# Altium project StrathimFlightControllerV1.0.PrjPcb
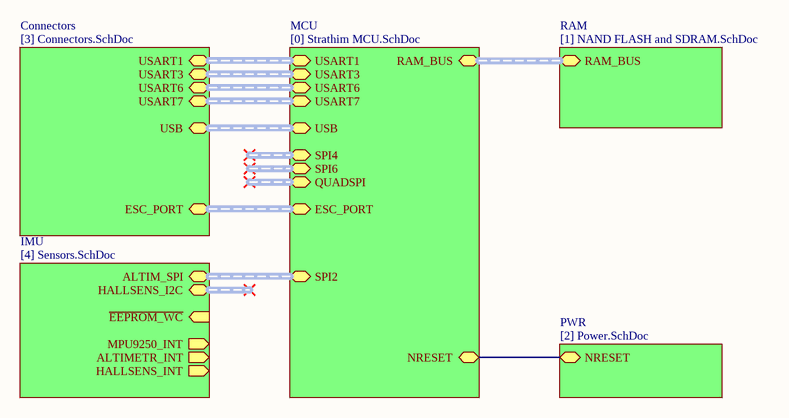
[diagram p0: Strathim block-scheme.SchDoc]
6 sheets, 125 parts. Net scope: hierarchical (ports join the sheet entries above them; power ports are global).
Board file: Strathim PCB V1.0 (1 try).PcbDoc
Sheets:
  Strathim block-scheme.SchDoc
    MCU = [0] Strathim MCU.SchDoc
    RAM = [1] NAND FLASH and SDRAM.SchDoc
    PWR = [2] Power.SchDoc
    Connectors = [3] Connectors.SchDoc
    IMU = [4] Sensors.SchDoc

## Sheet Strathim block-scheme.SchDoc
size A

### Sub-sheets
Connectors = [3] Connectors.SchDoc: USART1 (harness UART), USART6 (harness UART), USART3 (harness UART), USART7 (harness UART), ESC_PORT (harness ESC_CHANNELS), USB (harness USB)
IMU = [4] Sensors.SchDoc: MPU9250_INT (out), ALTIM_SPI (harness SPI), ~{EEPROM_WC} (in), HALLSENS_I2C (harness I2C), ALTIMETR_INT (out), HALLSENS_INT (out)
MCU = [0] Strathim MCU.SchDoc: RAM_BUS (harness RAM), USART6 (harness UART), USART3 (harness UART), ESC_PORT (harness ESC_CHANNELS), USART1 (harness UART), USART7 (harness UART), SPI4 (harness SPI), SPI2 (harness SPI), SPI6 (harness SPI), QUADSPI (harness QUADSPI), NRESET, USB (harness USB)
PWR = [2] Power.SchDoc: NRESET
RAM = [1] NAND FLASH and SDRAM.SchDoc: RAM_BUS (harness RAM)

### Nets
NRESET: sheet MCU/NRESET, sheet PWR/NRESET

### Buses and harness runs
harness sheet Connectors/ESC_PORT = sheet MCU/ESC_PORT
harness sheet Connectors/USART1 = sheet MCU/USART1
harness sheet Connectors/USART3 = sheet MCU/USART3
harness sheet Connectors/USART6 = sheet MCU/USART6
harness sheet Connectors/USART7 = sheet MCU/USART7
harness sheet Connectors/USB = sheet MCU/USB
harness sheet IMU/ALTIM_SPI = sheet MCU/SPI2
harness sheet MCU/RAM_BUS = sheet RAM/RAM_BUS

## Sheet [0] Strathim MCU.SchDoc
size A3
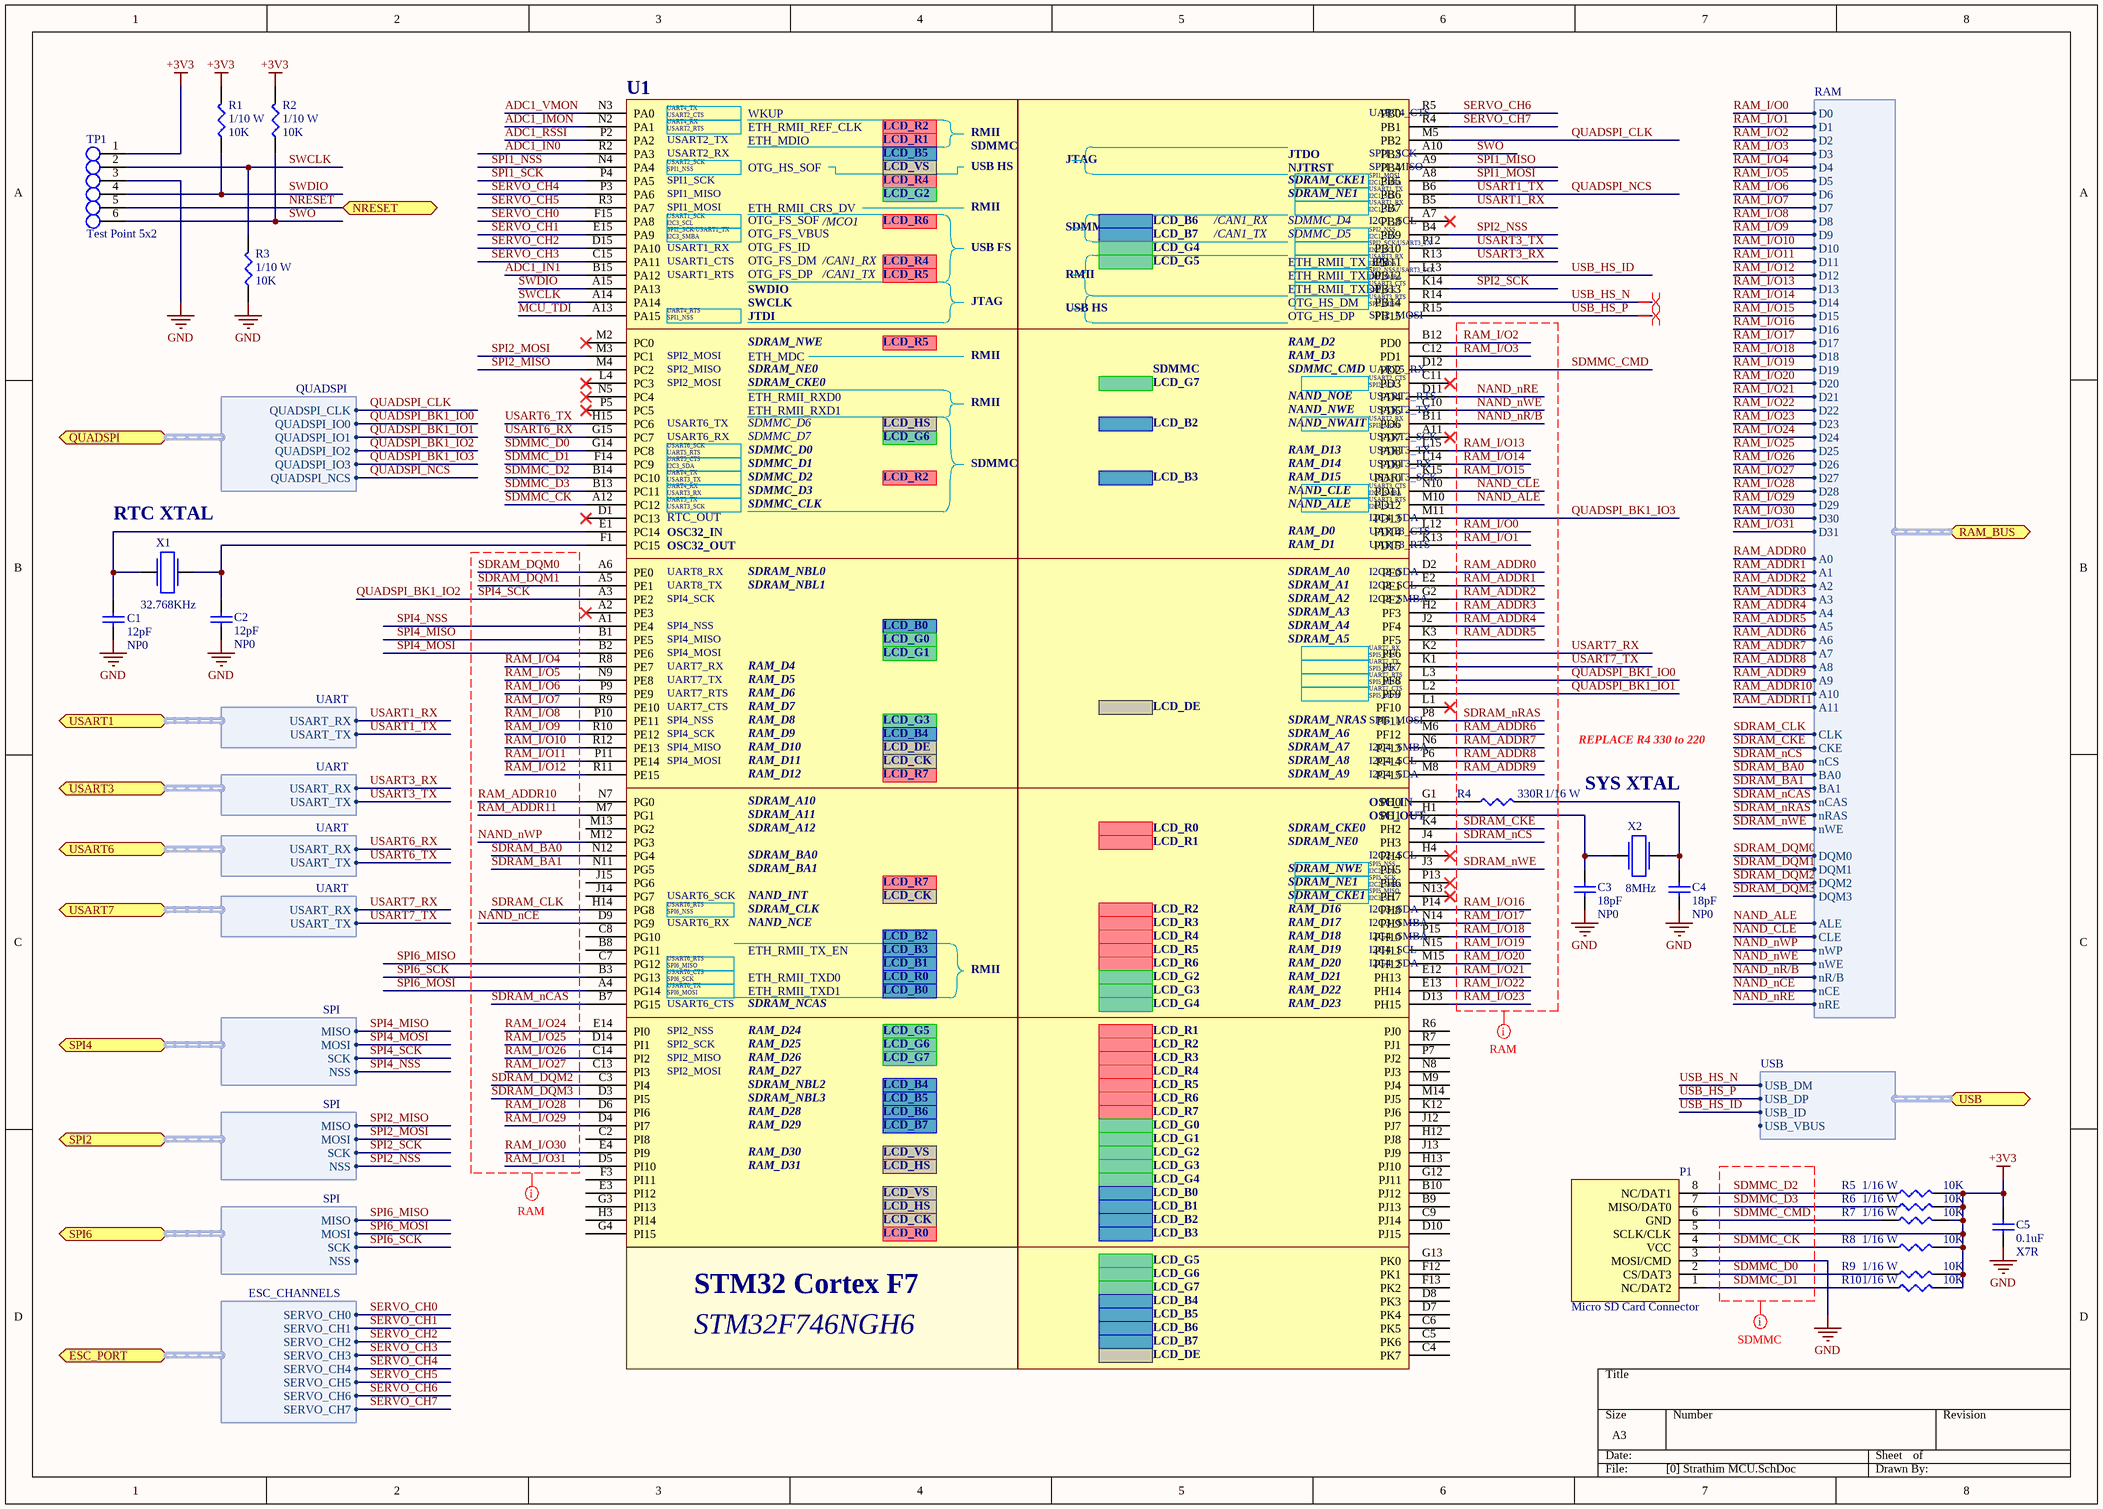
[diagram p1: [0] Strathim MCU.SchDoc]

### Parts
C1  value 12pF  Type: NP0  [CAP0402]  (hidden comment: ChipCap 12 NP0)
C2  value 12pF  Type: NP0  [CAP0402]  (hidden comment: ChipCap 12 NP0)
C3  value 18pF  Type: NP0  [CAP0402]  (hidden comment: ChipCap 18 NP0)
C4  value 18pF  Type: NP0  [CAP0402]  (hidden comment: ChipCap 18 NP0)
C5  value 0.1uF  Type: X7R  [CAP0402]  (hidden comment: ChipCap 0.1u X7R)
P1  Micro SD Card Connector  [WR-CRD SD Micro]
R1  value 10K  Rating: 1/10 W  [RES0603]  (hidden comment: RES0603 10K 1%)
R2  value 10K  Rating: 1/10 W  [RES0603]  (hidden comment: RES0603 10K 1%)
R3  value 10K  Rating: 1/10 W  [RES0603]  (hidden comment: RES0603 10K 1%)
R4  value 330R  Rating: 1/16 W  [RES0402]  (hidden comment: RES0402 330R 1%)
R5  value 10K  Rating: 1/16 W  [RES0402]  (hidden comment: RES0402 10K 1%)
R6  value 10K  Rating: 1/16 W  [RES0402]  (hidden comment: RES0402 10K 1%)
R7  value 10K  Rating: 1/16 W  [RES0402]  (hidden comment: RES0402 10K 1%)
R8  value 10K  Rating: 1/16 W  [RES0402]  (hidden comment: RES0402 10K 1%)
R9  value 10K  Rating: 1/16 W  [RES0402]  (hidden comment: RES0402 10K 1%)
R10  value 10K  Rating: 1/16 W  [RES0402]  (hidden comment: RES0402 10K 1%)
TP1  Test Point 5x2  [PG-1.5-13.5-6P-2.54PH]
U1  STM32F746NGH6  [TFBGA216]  (value not drawn)  (parts A,B,C,D,E,F,G,H,I,J,K of 12)
X1  value 32.768KHz  [KX-327NHT]  (hidden comment: XTAL)
X2  value 8MHz  [ABM3 Ceramic Crystal]  (hidden comment: XTAL)

### Ports
ESC_PORT (harness ESC_CHANNELS), NRESET, QUADSPI (harness QUADSPI), RAM_BUS (harness RAM), SPI2 (harness SPI), SPI4 (harness SPI), SPI6 (harness SPI), USART1 (harness UART), USART3 (harness UART), USART6 (harness UART), USART7 (harness UART), USB (harness USB)

### Harnesses
RAM: D0, D1, D2, D3, D4, D6, D7, D8, D9, D10, D11, D12, D13, D14, D15, D16, D17, D18, D19, D20, D21, D22, D23, D24, D25, D26, D27, D28, D29, D30, D31, A0, A1, A2, A3, A4, A5, A6, A7, A8, A9, A10, A11, CLK, CKE, nCS, BA0, BA1, nCAS, nRAS, nWE, DQM0, DQM1, DQM2, DQM3, ALE, CLE, nWP, nWE, nR/B, nCE, nRE, D5
ESC_CHANNELS: SERVO_CH0, SERVO_CH1, SERVO_CH2, SERVO_CH3, SERVO_CH4, SERVO_CH5, SERVO_CH6, SERVO_CH7
UART: USART_RX, USART_TX
SPI: MISO, MOSI, SCK, NSS
QUADSPI: QUADSPI_CLK, QUADSPI_IO0, QUADSPI_IO1, QUADSPI_IO2, QUADSPI_IO3, QUADSPI_NCS
USB: USB_DM, USB_DP, USB_ID, USB_VBUS

### Nets
+3V3: C5.2 P1.5(SCLK/CLK) R1.2 R2.2 R5.2 R6.2 R7.2 R8.2 R9.2 R10.2 TP1.1
GND: C1.1 C2.1 C3.1 C4.1 C5.1 P1.3(MOSI/CMD) R3.1 TP1.3
ADC1_IMON: U1.N2(PA1)
ADC1_IN0: U1.R2(PA3)
ADC1_IN1: U1.B15(PA12)
ADC1_RSSI: U1.P2(PA2)
ADC1_VMON: U1.N3(PA0)
MCU_TDI: U1.A13(PA15)
NAND_ALE: U1.M10(PD12) ; port RAM_BUS.ALE
NAND_CLE: U1.N10(PD11) ; port RAM_BUS.CLE
NAND_nCE: U1.D9(PG9) ; port RAM_BUS.nCE
NAND_nR/B: U1.B11(PD6) ; port RAM_BUS.nR/B
NAND_nRE: U1.D11(PD4) ; port RAM_BUS.nRE
NAND_nWE: U1.C10(PD5) U1.J3(PH5) ; port RAM_BUS.nWE  [also labelled SDRAM_nWE]
NAND_nWP: U1.M12(PG3) ; port RAM_BUS.nWP
NRESET: TP1.5 ; port NRESET
QUADSPI_BK1_IO0: U1.L3(PF8) ; port QUADSPI.QUADSPI_IO0
QUADSPI_BK1_IO1: U1.L2(PF9) ; port QUADSPI.QUADSPI_IO1
QUADSPI_BK1_IO2: U1.A3(PE2) ; port SPI4.SCK, port QUADSPI.QUADSPI_IO2  [also labelled SPI4_SCK]
QUADSPI_BK1_IO3: U1.M11(PD13) ; port QUADSPI.QUADSPI_IO3
QUADSPI_CLK: U1.M5(PB2) ; port QUADSPI.QUADSPI_CLK
QUADSPI_NCS: U1.B6(PB6) ; port USART1.USART_TX, port QUADSPI.QUADSPI_NCS  [also labelled USART1_TX]
RAM_ADDR0: U1.D2(PF0) ; port RAM_BUS.A0
RAM_ADDR1: U1.E2(PF1) ; port RAM_BUS.A1
RAM_ADDR2: U1.G2(PF2) ; port RAM_BUS.A2
RAM_ADDR3: U1.H2(PF3) ; port RAM_BUS.A3
RAM_ADDR4: U1.J2(PF4) ; port RAM_BUS.A4
RAM_ADDR5: U1.K3(PF5) ; port RAM_BUS.A5
RAM_ADDR6: U1.M6(PF12) ; port RAM_BUS.A6
RAM_ADDR7: U1.N6(PF13) ; port RAM_BUS.A7
RAM_ADDR8: U1.P6(PF14) ; port RAM_BUS.A8
RAM_ADDR9: U1.M8(PF15) ; port RAM_BUS.A9
RAM_ADDR10: U1.N7(PG0) ; port RAM_BUS.A10
RAM_ADDR11: U1.M7(PG1) ; port RAM_BUS.A11
RAM_I/O0: U1.L12(PD14) ; port RAM_BUS.D0
RAM_I/O1: U1.K13(PD15) ; port RAM_BUS.D1
RAM_I/O2: U1.B12(PD0) ; port RAM_BUS.D2
RAM_I/O3: U1.C12(PD1) ; port RAM_BUS.D3
RAM_I/O4: U1.R8(PE7) ; port RAM_BUS.D4
RAM_I/O5: U1.N9(PE8) ; port RAM_BUS.D5
RAM_I/O6: U1.P9(PE9) ; port RAM_BUS.D6
RAM_I/O7: U1.R9(PE10) ; port RAM_BUS.D7
RAM_I/O8: U1.P10(PE11) ; port RAM_BUS.D8
RAM_I/O9: U1.R10(PE12) ; port RAM_BUS.D9
RAM_I/O10: U1.R12(PE13) ; port RAM_BUS.D10
RAM_I/O11: U1.P11(PE14) ; port RAM_BUS.D11
RAM_I/O12: U1.R11(PE15) ; port RAM_BUS.D12
RAM_I/O13: U1.L15(PD8) ; port RAM_BUS.D13
RAM_I/O14: U1.L14(PD9) ; port RAM_BUS.D14
RAM_I/O15: U1.K15(PD10) ; port RAM_BUS.D15
RAM_I/O16: U1.P14(PH8) ; port RAM_BUS.D16
RAM_I/O17: U1.N14(PH9) ; port RAM_BUS.D17
RAM_I/O18: U1.P15(PH10) ; port RAM_BUS.D18
RAM_I/O19: U1.N15(PH11) ; port RAM_BUS.D19
RAM_I/O20: U1.M15(PH12) ; port RAM_BUS.D20
RAM_I/O21: U1.E12(PH13) ; port RAM_BUS.D21
RAM_I/O22: U1.E13(PH14) ; port RAM_BUS.D22
RAM_I/O23: U1.D13(PH15) ; port RAM_BUS.D23
RAM_I/O24: U1.E14(PI0) ; port RAM_BUS.D24
RAM_I/O25: U1.D14(PI1) ; port RAM_BUS.D25
RAM_I/O26: U1.C14(PI2) ; port RAM_BUS.D26
RAM_I/O27: U1.C13(PI3) ; port RAM_BUS.D27
RAM_I/O28: U1.D6(PI6) ; port RAM_BUS.D28
RAM_I/O29: U1.D4(PI7) ; port RAM_BUS.D29
RAM_I/O30: U1.E4(PI9) ; port RAM_BUS.D30
RAM_I/O31: U1.D5(PI10) ; port RAM_BUS.D31
SDMMC_CK: P1.4(VCC) R8.1 U1.A12(PC12)
SDMMC_CMD: P1.6(GND) R7.1 U1.D12(PD2)
SDMMC_D0: P1.2(CS/DAT3) R9.1 U1.G14(PC8)
SDMMC_D1: P1.1(NC/DAT2) R10.1 U1.F14(PC9)
SDMMC_D2: P1.8(NC/DAT1) R5.1 U1.B14(PC10)
SDMMC_D3: P1.7(MISO/DAT0) R6.1 U1.B13(PC11)
SDRAM_BA0: U1.N12(PG4) ; port RAM_BUS.BA0
SDRAM_BA1: U1.N11(PG5) ; port RAM_BUS.BA1
SDRAM_CKE: U1.K4(PH2) ; port RAM_BUS.CKE
SDRAM_CLK: U1.H14(PG8) ; port RAM_BUS.CLK
SDRAM_DQM0: U1.A6(PE0) ; port RAM_BUS.DQM0
SDRAM_DQM1: U1.A5(PE1) ; port RAM_BUS.DQM1
SDRAM_DQM2: U1.C3(PI4) ; port RAM_BUS.DQM2
SDRAM_DQM3: U1.D3(PI5) ; port RAM_BUS.DQM3
SDRAM_nCAS: U1.B7(PG15) ; port RAM_BUS.nCAS
SDRAM_nCS: U1.J4(PH3) ; port RAM_BUS.nCS
SDRAM_nRAS: U1.P8(PF11) ; port RAM_BUS.nRAS
SERVO_CH0: U1.F15(PA8) ; port ESC_PORT.SERVO_CH0
SERVO_CH1: U1.E15(PA9) ; port ESC_PORT.SERVO_CH1
SERVO_CH2: U1.D15(PA10) ; port ESC_PORT.SERVO_CH2
SERVO_CH3: U1.C15(PA11) ; port ESC_PORT.SERVO_CH3
SERVO_CH4: U1.P3(PA6) ; port ESC_PORT.SERVO_CH4
SERVO_CH5: U1.R3(PA7) ; port ESC_PORT.SERVO_CH5
SERVO_CH6: U1.R5(PB0) ; port ESC_PORT.SERVO_CH6
SERVO_CH7: U1.R4(PB1) ; port ESC_PORT.SERVO_CH7
SPI1_MISO: U1.A9(PB4)
SPI1_MOSI: U1.A8(PB5)
SPI1_NSS: U1.N4(PA4)
SPI1_SCK: U1.P4(PA5)
SPI2_MISO: U1.M4(PC2) ; port SPI2.MISO  [project net ALT_MISO]
SPI2_MOSI: U1.M3(PC1) ; port SPI2.MOSI  [project net ALT_MOSI]
SPI2_NSS: U1.B4(PB9) ; port SPI2.NSS  [project net ALT_CS]
SPI2_SCK: U1.K14(PB13) ; port SPI2.SCK  [project net ALT_SCLK]
SPI4_MISO: U1.B1(PE5) ; port SPI4.MISO
SPI4_MOSI: U1.B2(PE6) ; port SPI4.MOSI
SPI4_NSS: U1.A1(PE4) ; port SPI4.NSS
SPI6_MISO: U1.C7(PG12) ; port SPI6.MISO
SPI6_MOSI: U1.A4(PG14) ; port SPI6.MOSI
SPI6_SCK: U1.B3(PG13) ; port SPI6.SCK
SWCLK: R3.2 TP1.2 U1.A14(PA14)
SWDIO: R1.1 TP1.4 U1.A15(PA13)
SWO: R2.1 TP1.6 U1.A10(PB3)
USART1_RX: U1.B5(PB7) ; port USART1.USART_RX
USART3_RX: U1.R13(PB11) ; port USART3.USART_RX
USART3_TX: U1.P12(PB10) ; port USART3.USART_TX
USART6_RX: U1.G15(PC7) ; port USART6.USART_RX
USART6_TX: U1.H15(PC6) ; port USART6.USART_TX
USART7_RX: U1.K2(PF6) ; port USART7.USART_RX
USART7_TX: U1.K1(PF7) ; port USART7.USART_TX
USB_HS_ID: U1.L13(PB12) ; port USB.USB_ID
USB_HS_N: U1.R14(PB14) ; port USB.USB_DM
USB_HS_P: U1.R15(PB15) ; port USB.USB_DP
NetC1_2: C1.2 U1.E1(PC14) X1.1
NetC2_2: C2.2 U1.F1(PC15) X1.2
NetC3_2: C3.2 U1.H1(PH1) X2.1
NetC4_2: C4.2 R4.2 X2.2
NetR4_1: R4.1 U1.G1(PH0)

Not connected (* = marked no-connect by the designer): U1 A2(PE3)* A7(PB8)* A11(PD7)* B8(PG11) B9(PJ13) B10(PJ12) C2(PI8) C4(PK7) C5(PK6) C6(PK5) C8(PG10) C9(PJ14) C11(PD3)* D1(PC13)* D7(PK4) D8(PK3) D10(PJ15) E3(PI12) F3(PI11) F12(PK1) F13(PK2) G3(PI13) G4(PI15) G12(PJ11) G13(PK0) H3(PI14) H4(PH4)* H12(PJ8) H13(PJ10) J12(PJ7) J13(PJ9) J14(PG7) J15(PG6) K12(PJ6) L1(PF10)* L4(PC3)* M2(PC0)* M9(PJ4) M13(PG2) M14(PJ5) N5(PC4)* N8(PJ3) N13(PH7)* P5(PC5)* P7(PJ2) P13(PH6)* R6(PJ0) R7(PJ1)

### Layout directives
net class SDMMC: SDMMC_CK, SDMMC_CMD, SDMMC_D0, SDMMC_D1, SDMMC_D2, SDMMC_D3
net class RAM: NAND_ALE, NAND_CLE, NAND_nCE, NAND_nR/B, NAND_nRE, NAND_nWE, NAND_nWP, RAM_ADDR0, RAM_ADDR1, RAM_ADDR2, RAM_ADDR3, RAM_ADDR4, RAM_ADDR5, RAM_ADDR6, RAM_ADDR7, RAM_ADDR8, RAM_ADDR9, RAM_ADDR10, RAM_ADDR11, RAM_I/O0, RAM_I/O1, RAM_I/O2, RAM_I/O3, RAM_I/O4, RAM_I/O5, RAM_I/O6, RAM_I/O7, RAM_I/O8, RAM_I/O9, RAM_I/O10, RAM_I/O11, RAM_I/O12, RAM_I/O13, RAM_I/O14, RAM_I/O15, RAM_I/O16, RAM_I/O17, RAM_I/O18, RAM_I/O19, RAM_I/O20, RAM_I/O21, RAM_I/O22, RAM_I/O23, RAM_I/O24, RAM_I/O25, RAM_I/O26, RAM_I/O27, RAM_I/O28, RAM_I/O29, RAM_I/O30, RAM_I/O31, SDRAM_BA0, SDRAM_BA1, SDRAM_CKE, SDRAM_CLK, SDRAM_DQM0, SDRAM_DQM1, SDRAM_DQM2, SDRAM_DQM3, SDRAM_nCAS, SDRAM_nCS, SDRAM_nRAS, SDRAM_nWE, SPI4_SCK
differential pair: USB_HS_N, USB_HS_P

### Notes on the sheet
- (near U1) U1
- (near X1) RTC XTAL
- REPLACE R4 330 to 220
- SYS XTAL
- STM32 Cortex F7
- STM32F746NGH6
- (in symbol STM32F746NGH6, part A) UART4_TX; WKUP; USART2_CTS; UART4_RX; ETH_RMII_REF_CLK; USART2_RTS; LCD_R2; ETH_MDIO; RMII; USART2_TX; LCD_R1; SDMMC; USART2_RX; LCD_B5; USART2_SCK; OTG_HS_SOF; SPI1_NSS; LCD_VS; USB HS; SPI1_SCK; LCD_R4; SPI1_MISO; LCD_G2; ETH_RMII_CRS_DV; SPI1_MOSI; USART1_SCK; /MCO1; I2C3_SCL; OTG_FS_SOF; LCD_R6; SPI2_SCK/USART1_TX; I2C3_SMBA; OTG_FS_VBUS; USART1_RX; OTG_FS_ID; USB FS; USART1_CTS; OTG_FS_DM; /CAN1_RX; USART1_RTS; OTG_FS_DP; /CAN1_TX; LCD_R5; SWDIO; SWCLK; JTAG; UART4_RTS; JTDI
- (in symbol STM32F746NGH6, part B) UART4_CTS; JTDO; SPI1_SCK; JTAG; NJTRST; SPI1_MISO; SPI1_MOSI; SDRAM_CKE1; I2C1_SMBA; USART1_TX; SDRAM_NE1; I2C1_SCL; USART1_RX; I2C1_SDA; LCD_B6; /CAN1_RX; SDMMC_D4; SDMMC; SPI2_NSS; LCD_B7; /CAN1_TX; SDMMC_D5; SPI2_SCK/USART3_TX; LCD_G4; I2C2_SCL; ETH_RMII_TX_EN; USART3_RX; LCD_G5; I2C2_SDA; ETH_RMII_TXD0; SPI2_NSS/USART3_SCK; RMII; I2C2_SMBA; ETH_RMII_TXD1; USART3_CTS; SPI2_SCK; OTG_HS_DM; USART3_RTS; SPI2_MISO; USB HS; OTG_HS_DP; SPI2_MOSI
- (in symbol STM32F746NGH6, part C) SDRAM_NWE; LCD_R5; ETH_MDC; SPI2_MOSI; RMII; SPI2_MISO; SDRAM_NE0; SDRAM_CKE0; ETH_RMII_RXD0; ETH_RMII_RXD1; USART6_TX; SDMMC_D6; LCD_HS; USART6_RX; SDMMC_D7; LCD_G6; USART6_SCK; UART5_RTS; SDMMC_D0; UART5_CTS; I2C3_SDA; SDMMC_D1; SDMMC; UART4_TX; USART3_TX; SDMMC_D2; LCD_R2; UART4_RX; USART3_RX; SDMMC_D3; UART5_TX; USART3_SCK; SDMMC_CLK; RTC_OUT; OSC32_IN; OSC32_OUT
- (in symbol STM32F746NGH6, part D) RAM_D2; RAM_D3; SDMMC; SDMMC_CMD; UART5_RX; USART2_CTS; LCD_G7; SPI2_SCK; NAND_NOE; USART2_RTS; NAND_NWE; USART2_TX; USART2_RX; LCD_B2; NAND_NWAIT; SPI3_MOSI; USART2_SCK; RAM_D13; USART3_TX; RAM_D14; USART3_RX; LCD_B3; RAM_D15; USART3_SCK; USART3_CTS; NAND_CLE; I2C4_SMBA; USART3_RTS; NAND_ALE; I2C4_SCL; I2C4_SDA; RAM_D0; UART8_CTS; RAM_D1; UART8_RTS
- (in symbol STM32F746NGH6, part E) UART8_RX; SDRAM_NBL0; UART8_TX; SDRAM_NBL1; SPI4_SCK; SPI4_NSS; LCD_B0; SPI4_MISO; LCD_G0; SPI4_MOSI; LCD_G1; UART7_RX; RAM_D4; UART7_TX; RAM_D5; UART7_RTS; RAM_D6; UART7_CTS; RAM_D7; RAM_D8; LCD_G3; RAM_D9; LCD_B4; RAM_D10; LCD_DE; RAM_D11; LCD_CK; RAM_D12; LCD_R7
- (in symbol STM32F746NGH6, part F) SDRAM_A0; I2C2_SDA; SDRAM_A1; I2C2_SCL; SDRAM_A2; I2C2_SMBA; SDRAM_A3; SDRAM_A4; SDRAM_A5; UART7_RX; SPI5_NSS; UART7_TX; SPI5_SCK; UART7_RTS; SPI5_MISO; UART7_CTS; SPI5_MOSI; LCD_DE; SDRAM_NRAS; SDRAM_A6; SDRAM_A7; I2C4_SMBA; SDRAM_A8; I2C4_SCL; SDRAM_A9; I2C4_SDA
- (in symbol STM32F746NGH6, part G) SDRAM_A10; SDRAM_A11; SDRAM_A12; SDRAM_BA0; SDRAM_BA1; LCD_R7; USART6_SCK; NAND_INT; LCD_CK; USART6_RTS; SPI6_NSS; SDRAM_CLK; USART6_RX; NAND_NCE; LCD_B2; ETH_RMII_TX_EN; LCD_B3; SPI6_MISO; LCD_B1; USART6_CTS; ETH_RMII_TXD0; RMII; SPI6_SCK; LCD_R0; USART6_TX; ETH_RMII_TXD1; SPI6_MOSI; LCD_B0; SDRAM_NCAS
- (in symbol STM32F746NGH6, part H) OSC_IN; OSC_OUT; LCD_R0; SDRAM_CKE0; LCD_R1; SDRAM_NE0; I2C2_SCL; SPI5_NSS; SDRAM_NWE; I2C2_SDA; SPI5_SCK; SDRAM_NE1; I2C2_SMBA; SPI5_MISO; SDRAM_CKE1; I2C3_SCL; LCD_R2; RAM_D16; I2C3_SDA; LCD_R3; RAM_D17; I2C3_SMBA; LCD_R4; RAM_D18; I2C4_SMBA; LCD_R5; RAM_D19; I2C4_SCL; LCD_R6; RAM_D20; I2C4_SDA; LCD_G2; RAM_D21; LCD_G3; RAM_D22; LCD_G4; RAM_D23
- (in symbol STM32F746NGH6, part I) SPI2_NSS; RAM_D24; LCD_G5; SPI2_SCK; RAM_D25; LCD_G6; SPI2_MISO; RAM_D26; LCD_G7; SPI2_MOSI; RAM_D27; SDRAM_NBL2; LCD_B4; SDRAM_NBL3; LCD_B5; RAM_D28; LCD_B6; RAM_D29; LCD_B7; RAM_D30; LCD_VS; RAM_D31; LCD_HS; LCD_CK; LCD_R0
- (in symbol STM32F746NGH6, part J) LCD_R1; LCD_R2; LCD_R3; LCD_R4; LCD_R5; LCD_R6; LCD_R7; LCD_G0; LCD_G1; LCD_G2; LCD_G3; LCD_G4; LCD_B0; LCD_B1; LCD_B2; LCD_B3
- (in symbol STM32F746NGH6, part K) LCD_G5; LCD_G6; LCD_G7; LCD_B4; LCD_B5; LCD_B6; LCD_B7; LCD_DE

### Library data of the parts
C1 C2 = ChipCap 12 NP0: Surface-mount ceramic multilayer capacitor; Manufacturer: YAGEO; Voltage: 100V; Tolerance: 0.1pF; ComponentLink1Description: Datasheet; ComponentLink1URL: http://www.deaha.com/pdf/YAGEO-CC_series.pdf
C3 C4 = ChipCap 18 NP0: Surface-mount ceramic multilayer capacitor; Manufacturer: YAGEO; Voltage: 100V; Tolerance: 0.1pF; ComponentLink1Description: Datasheet; ComponentLink1URL: http://www.deaha.com/pdf/YAGEO-CC_series.pdf
C5 = ChipCap 0.1uF X7R: Surface-mount ceramic multilayer capacitor; Manufacturer: YAGEO; Voltage: 100V; Tolerance: 10%; ComponentLink1Description: Datasheet; ComponentLink1URL: http://www.deaha.com/pdf/YAGEO-CC_series.pdf
P1 = MicroSDHeader8
R1-R3 = RES0603 10K 1%: Think Film Chip resistor; Manufacturer Part Number: RC0603FR-0710KL (YAG); Temperature Coefficient: 100ppm/K; Tolerance: 1%; Type: ThickFilm
R4 = RES0402 330R 1%: Think Film Chip resistor; Manufacturer Part Number: RC0402FR-07330RL (YAG); Temperature Coefficient: 100ppm/K; Tolerance: 1%; Type: ThickFilm
R5-R10 = RES0402 10K 1%: Think Film Chip resistor; Manufacturer Part Number: RC0402FR-0710KL; Temperature Coefficient: 100ppm/K; Tolerance: 1%; Type: ThickFilm
TP1 = PG-1.5-13.5-6P-2.54PH
U1 = STM32F746NGH6: ARM Cortex M7, 462DMIPS, 1MB Flash
X1 = Crystall oscillator: Quartz crystall oscillator
X2 = ABM3 Ceramic SMD Crystal: Quartz crystall oscillator

## Sheet [1] NAND FLASH and SDRAM.SchDoc
size A4
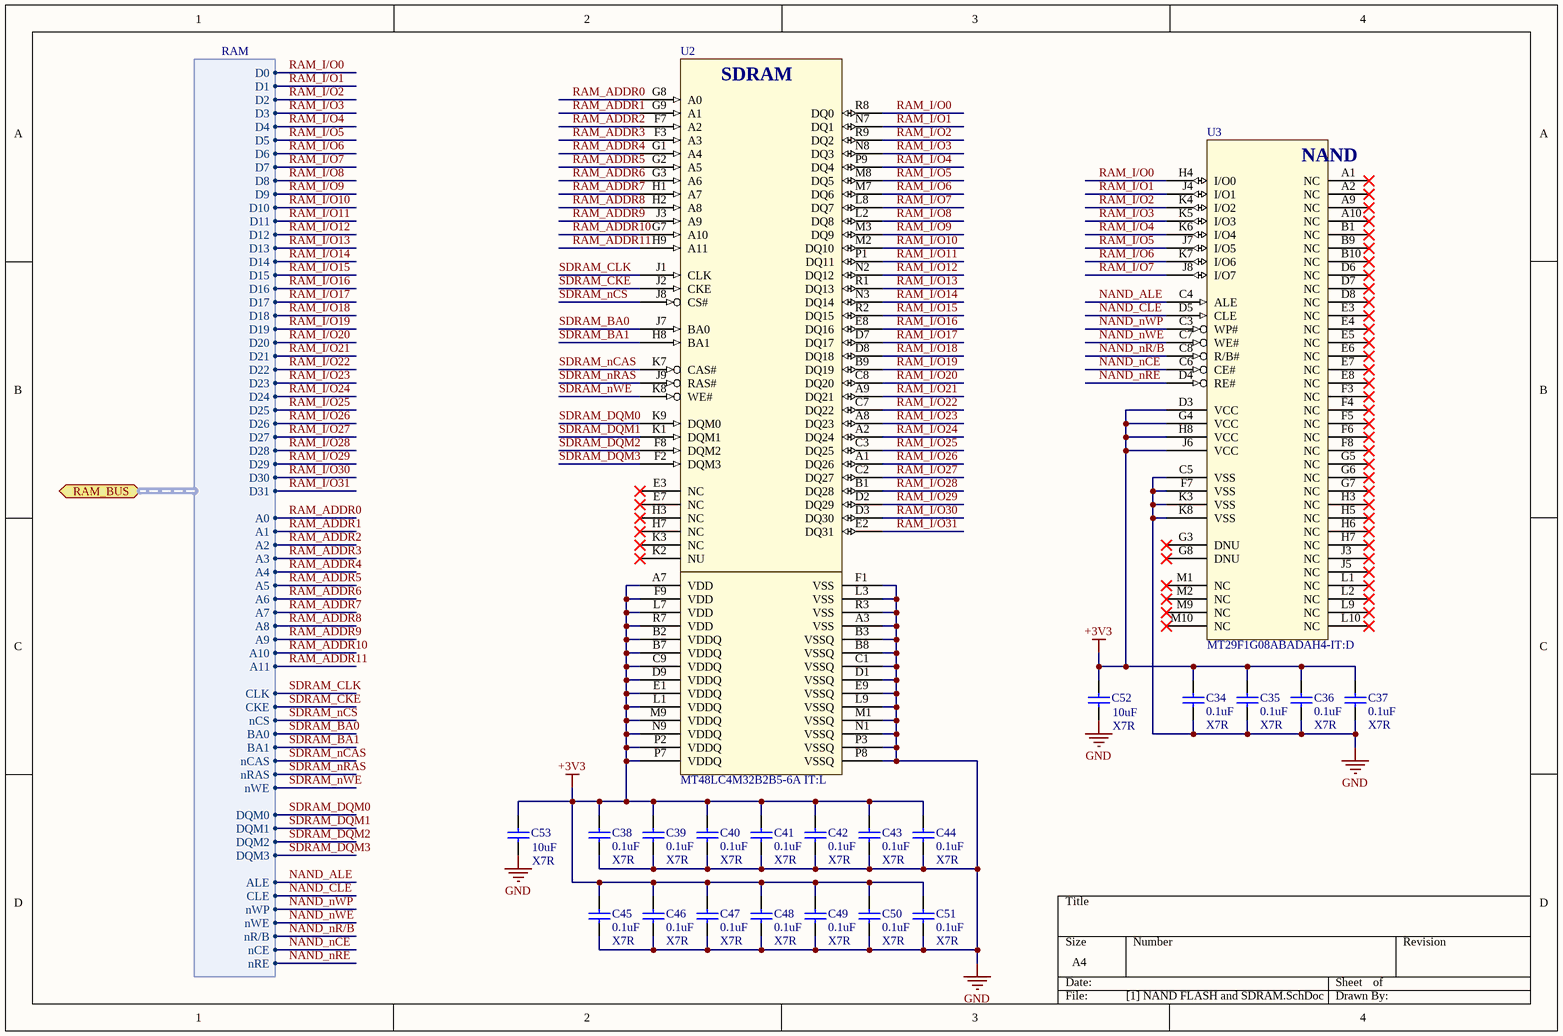
[diagram p2: [1] NAND FLASH and SDRAM.SchDoc]

### Parts
C34  value 0.1uF  Type: X7R  [CAP0201]  (hidden comment: ChipCap 0.1u X7R)
C35  value 0.1uF  Type: X7R  [CAP0201]  (hidden comment: ChipCap 0.1u X7R)
C36  value 0.1uF  Type: X7R  [CAP0201]  (hidden comment: ChipCap 0.1u X7R)
C37  value 0.1uF  Type: X7R  [CAP0201]  (hidden comment: ChipCap 0.1u X7R)
C38  value 0.1uF  Type: X7R  [CAP0201]  (hidden comment: ChipCap 0.1u X7R)
C39  value 0.1uF  Type: X7R  [CAP0201]  (hidden comment: ChipCap 0.1u X7R)
C40  value 0.1uF  Type: X7R  [CAP0201]  (hidden comment: ChipCap 0.1u X7R)
C41  value 0.1uF  Type: X7R  [CAP0201]  (hidden comment: ChipCap 0.1u X7R)
C42  value 0.1uF  Type: X7R  [CAP0201]  (hidden comment: ChipCap 0.1u X7R)
C43  value 0.1uF  Type: X7R  [CAP0201]  (hidden comment: ChipCap 0.1u X7R)
C44  value 0.1uF  Type: X7R  [CAP0201]  (hidden comment: ChipCap 0.1u X7R)
C45  value 0.1uF  Type: X7R  [CAP0201]  (hidden comment: ChipCap 0.1u X7R)
C46  value 0.1uF  Type: X7R  [CAP0201]  (hidden comment: ChipCap 0.1u X7R)
C47  value 0.1uF  Type: X7R  [CAP0201]  (hidden comment: ChipCap 0.1u X7R)
C48  value 0.1uF  Type: X7R  [CAP0201]  (hidden comment: ChipCap 0.1u X7R)
C49  value 0.1uF  Type: X7R  [CAP0201]  (hidden comment: ChipCap 0.1u X7R)
C50  value 0.1uF  Type: X7R  [CAP0201]  (hidden comment: ChipCap 0.1u X7R)
C51  value 0.1uF  Type: X7R  [CAP0201]  (hidden comment: ChipCap 0.1u X7R)
C52  value 10uF  Type: X7R  [CAP0805]  (hidden comment: ChipCap 10u X7R)
C53  value 10uF  Type: X7R  [CAP0805]  (hidden comment: ChipCap 10u X7R)
U2  MT48LC4M32B2B5-6A IT:L  [VFBGA-90]
U3  MT29F1G08ABADAH4-IT:D  [VFBGA-63 (H4 9x11)]

### Ports
RAM_BUS (harness RAM)

### Harnesses
RAM: D0, D1, D2, D3, D4, D6, D7, D8, D9, D10, D11, D12, D13, D14, D15, D16, D17, D18, D19, D20, D21, D22, D23, D24, D25, D26, D27, D28, D29, D30, D31, A0, A1, A2, A3, A4, A5, A6, A7, A8, A9, A10, A11, CLK, CKE, nCS, BA0, BA1, nCAS, nRAS, nWE, DQM0, DQM1, DQM2, DQM3, ALE, CLE, nWP, nWE, nR/B, nCE, nRE, D5

### Nets
+3V3: C34.2 C35.2 C36.2 C37.2 C38.2 C39.2 C40.2 C41.2 C42.2 C43.2 C44.2 C45.2 C46.2 C47.2 C48.2 C49.2 C50.2 C51.2 C52.2 C53.2 U2.A7(VDD) U2.B2(VDDQ) U2.B7(VDDQ) U2.C9(VDDQ) U2.D9(VDDQ) U2.E1(VDDQ) U2.F9(VDD) U2.L1(VDDQ) U2.L7(VDD) U2.M9(VDDQ) U2.N9(VDDQ) U2.P2(VDDQ) U2.P7(VDDQ) U2.R7(VDD) U3.D3(VCC) U3.G4(VCC) U3.H8(VCC) U3.J6(VCC)
GND: C34.1 C35.1 C36.1 C37.1 C38.1 C39.1 C40.1 C41.1 C42.1 C43.1 C44.1 C45.1 C46.1 C47.1 C48.1 C49.1 C50.1 C51.1 C52.1 C53.1 U2.A3(VSS) U2.B3(VSSQ) U2.B8(VSSQ) U2.C1(VSSQ) U2.D1(VSSQ) U2.E9(VSSQ) U2.F1(VSS) U2.L3(VSS) U2.L9(VSSQ) U2.M1(VSSQ) U2.N1(VSSQ) U2.P3(VSSQ) U2.P8(VSSQ) U2.R3(VSS) U3.C5(VSS) U3.F7(VSS) U3.K3(VSS) U3.K8(VSS)
NAND_ALE: U3.C4(ALE) ; port RAM_BUS.ALE
NAND_CLE: U3.D5(CLE) ; port RAM_BUS.CLE
NAND_nCE: U3.C6(CE#) ; port RAM_BUS.nCE
NAND_nR/B: U3.C8(R/B#) ; port RAM_BUS.nR/B
NAND_nRE: U3.D4(RE#) ; port RAM_BUS.nRE
NAND_nWE: U2.K8(WE#) U3.C7(WE#) ; port RAM_BUS.nWE  [also labelled SDRAM_nWE]
NAND_nWP: U3.C3(WP#) ; port RAM_BUS.nWP
RAM_ADDR0: U2.G8(A0) ; port RAM_BUS.A0
RAM_ADDR1: U2.G9(A1) ; port RAM_BUS.A1
RAM_ADDR2: U2.F7(A2) ; port RAM_BUS.A2
RAM_ADDR3: U2.F3(A3) ; port RAM_BUS.A3
RAM_ADDR4: U2.G1(A4) ; port RAM_BUS.A4
RAM_ADDR5: U2.G2(A5) ; port RAM_BUS.A5
RAM_ADDR6: U2.G3(A6) ; port RAM_BUS.A6
RAM_ADDR7: U2.H1(A7) ; port RAM_BUS.A7
RAM_ADDR8: U2.H2(A8) ; port RAM_BUS.A8
RAM_ADDR9: U2.J3(A9) ; port RAM_BUS.A9
RAM_ADDR10: U2.G7(A10) ; port RAM_BUS.A10
RAM_ADDR11: U2.H9(A11) ; port RAM_BUS.A11
RAM_I/O0: U2.R8(DQ0) U3.H4(I/O0) ; port RAM_BUS.D0
RAM_I/O1: U2.N7(DQ1) U3.J4(I/O1) ; port RAM_BUS.D1
RAM_I/O2: U2.R9(DQ2) U3.K4(I/O2) ; port RAM_BUS.D2
RAM_I/O3: U2.N8(DQ3) U3.K5(I/O3) ; port RAM_BUS.D3
RAM_I/O4: U2.P9(DQ4) U3.K6(I/O4) ; port RAM_BUS.D4
RAM_I/O5: U2.M8(DQ5) U3.J7(I/O5) ; port RAM_BUS.D5
RAM_I/O6: U2.M7(DQ6) U3.K7(I/O6) ; port RAM_BUS.D6
RAM_I/O7: U2.L8(DQ7) U3.J8(I/O7) ; port RAM_BUS.D7
RAM_I/O8: U2.L2(DQ8) ; port RAM_BUS.D8
RAM_I/O9: U2.M3(DQ9) ; port RAM_BUS.D9
RAM_I/O10: U2.M2(DQ10) ; port RAM_BUS.D10
RAM_I/O11: U2.P1(DQ11) ; port RAM_BUS.D11
RAM_I/O12: U2.N2(DQ12) ; port RAM_BUS.D12
RAM_I/O13: U2.R1(DQ13) ; port RAM_BUS.D13
RAM_I/O14: U2.N3(DQ14) ; port RAM_BUS.D14
RAM_I/O15: U2.R2(DQ15) ; port RAM_BUS.D15
RAM_I/O16: U2.E8(DQ16) ; port RAM_BUS.D16
RAM_I/O17: U2.D7(DQ17) ; port RAM_BUS.D17
RAM_I/O18: U2.D8(DQ18) ; port RAM_BUS.D18
RAM_I/O19: U2.B9(DQ19) ; port RAM_BUS.D19
RAM_I/O20: U2.C8(DQ20) ; port RAM_BUS.D20
RAM_I/O21: U2.A9(DQ21) ; port RAM_BUS.D21
RAM_I/O22: U2.C7(DQ22) ; port RAM_BUS.D22
RAM_I/O23: U2.A8(DQ23) ; port RAM_BUS.D23
RAM_I/O24: U2.A2(DQ24) ; port RAM_BUS.D24
RAM_I/O25: U2.C3(DQ25) ; port RAM_BUS.D25
RAM_I/O26: U2.A1(DQ26) ; port RAM_BUS.D26
RAM_I/O27: U2.C2(DQ27) ; port RAM_BUS.D27
RAM_I/O28: U2.B1(DQ28) ; port RAM_BUS.D28
RAM_I/O29: U2.D2(DQ29) ; port RAM_BUS.D29
RAM_I/O30: U2.D3(DQ30) ; port RAM_BUS.D30
RAM_I/O31: U2.E2(DQ31) ; port RAM_BUS.D31
SDRAM_BA0: U2.J7(BA0) ; port RAM_BUS.BA0
SDRAM_BA1: U2.H8(BA1) ; port RAM_BUS.BA1
SDRAM_CKE: U2.J2(CKE) ; port RAM_BUS.CKE
SDRAM_CLK: U2.J1(CLK) ; port RAM_BUS.CLK
SDRAM_DQM0: U2.K9(DQM0) ; port RAM_BUS.DQM0
SDRAM_DQM1: U2.K1(DQM1) ; port RAM_BUS.DQM1
SDRAM_DQM2: U2.F8(DQM2) ; port RAM_BUS.DQM2
SDRAM_DQM3: U2.F2(DQM3) ; port RAM_BUS.DQM3
SDRAM_nCAS: U2.K7(CAS#) ; port RAM_BUS.nCAS
SDRAM_nCS: U2.J8(CS#) ; port RAM_BUS.nCS
SDRAM_nRAS: U2.J9(RAS#) ; port RAM_BUS.nRAS

Not connected (* = marked no-connect by the designer): U2 E3(NC)* E7(NC)* H3(NC)* H7(NC)* K2(NU)* K3(NC)*; U3 A1(NC)* A2(NC)* A9(NC)* A10(NC)* B1(NC)* B9(NC)* B10(NC)* D6(NC)* D7(NC)* D8(NC)* E3(NC)* E4(NC)* E5(NC)* E6(NC)* E7(NC)* E8(NC)* F3(NC)* F4(NC)* F5(NC)* F6(NC)* F8(NC)* G3(DNU)* G5(NC)* G6(NC)* G7(NC)* G8(DNU)* H3(NC)* H5(NC)* H6(NC)* H7(NC)* J3(NC)* J5(NC)* L1(NC)* L2(NC)* L9(NC)* L10(NC)* M1(NC)* M2(NC)* M9(NC)* M10(NC)*

### Notes on the sheet
- (in symbol MT29F1G08ABADAH4-IT:D) NAND
- (in symbol MT48LC4M32B2B5-6A IT:L) SDRAM

### Library data of the parts
C34-C51 = ChipCap 0.1uF X7R: as C5 on sheet [0] Strathim MCU; ComponentLink1Description: Datasheet; ComponentLink1URL: http://www.deaha.com/pdf/YAGEO-CC_series.pdf
C52 C53 = ChipCap 10uF X7R: Surface-mount ceramic multilayer capacitor; Manufacturer: YAGEO; Voltage: 25V; Tolerance: 10%; ComponentLink1Description: Datasheet; ComponentLink1URL: http://www.deaha.com/pdf/YAGEO-CC_series.pdf
U2 = MT48LC4M32B2B5-6A IT:L: SDRAM 128Mbit
U3 = MT29F1G08ABADAH4-IT:D: FLASH RAM 1Gbit

## Sheet [2] Power.SchDoc
size A4
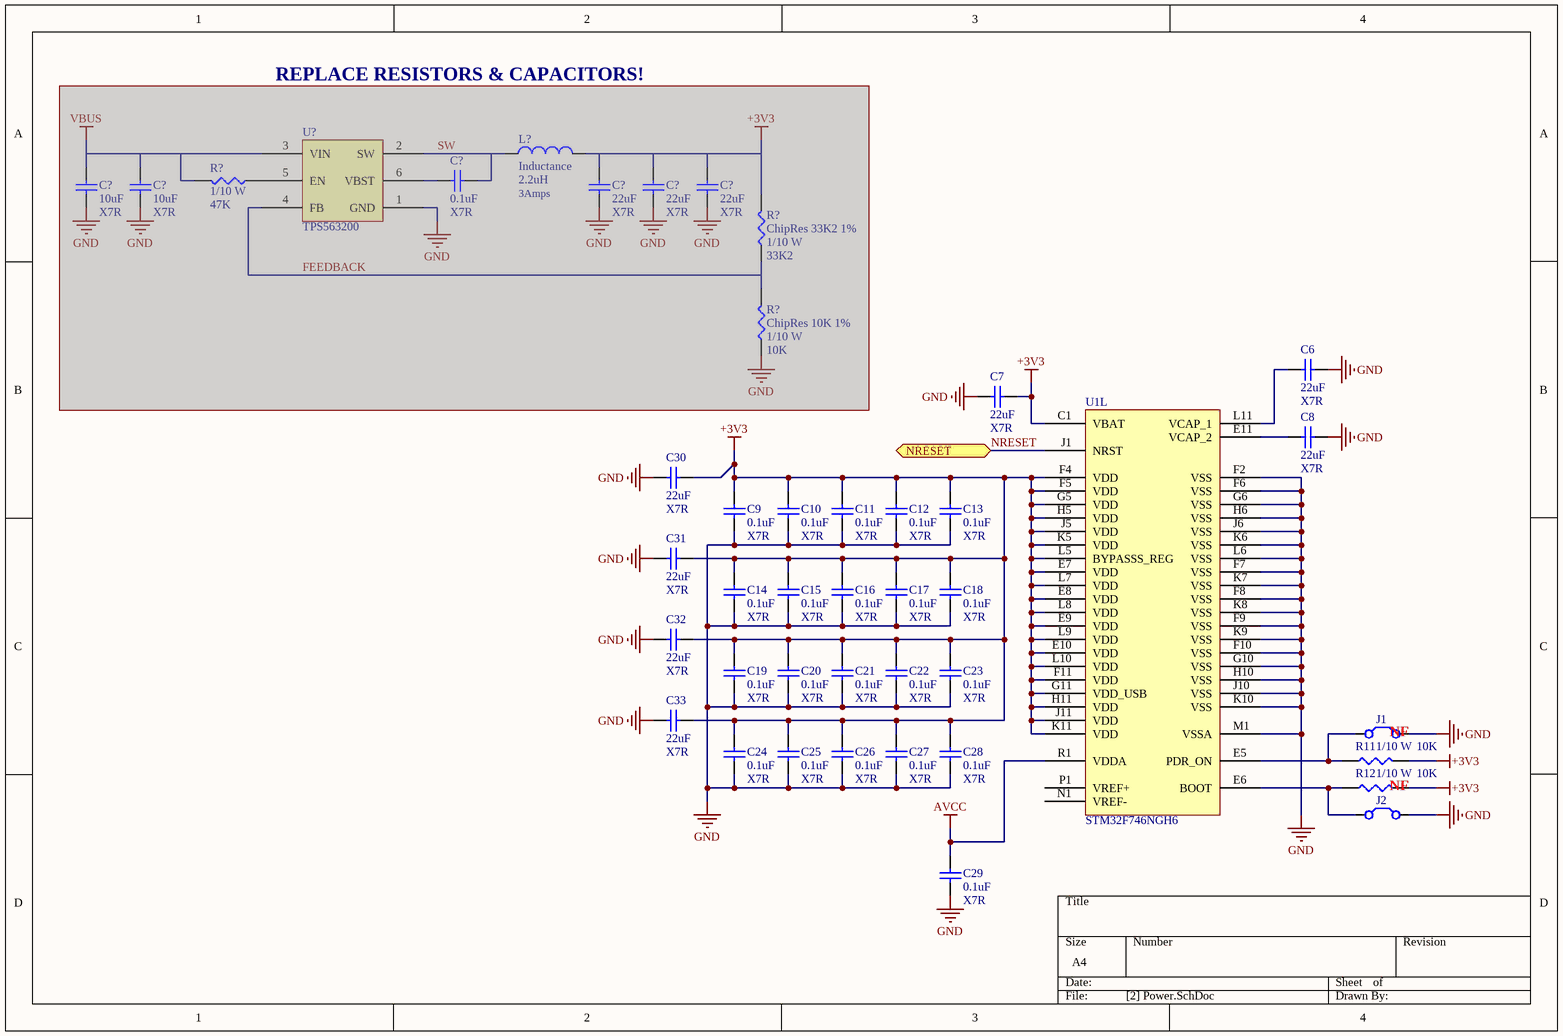
[diagram p3: [2] Power.SchDoc]

### Parts
(Parts that share a designator on the sheet are numbered #1, #2 ... from top to bottom, then left to right.)
C6  value 22uF  Type: X7R  [CAP0603]  (hidden comment: ChipCap 22u X7R)
C7  value 22uF  Type: X7R  [CAP0805]  (hidden comment: ChipCap 22u X7R)
C8  value 22uF  Type: X7R  [CAP0603]  (hidden comment: ChipCap 22u X7R)
C9  value 0.1uF  Type: X7R  [CAP0201]  (hidden comment: ChipCap 0.1u X7R)
C10  value 0.1uF  Type: X7R  [CAP0201]  (hidden comment: ChipCap 0.1u X7R)
C11  value 0.1uF  Type: X7R  [CAP0201]  (hidden comment: ChipCap 0.1u X7R)
C12  value 0.1uF  Type: X7R  [CAP0201]  (hidden comment: ChipCap 0.1u X7R)
C13  value 0.1uF  Type: X7R  [CAP0201]  (hidden comment: ChipCap 0.1u X7R)
C14  value 0.1uF  Type: X7R  [CAP0201]  (hidden comment: ChipCap 0.1u X7R)
C15  value 0.1uF  Type: X7R  [CAP0201]  (hidden comment: ChipCap 0.1u X7R)
C16  value 0.1uF  Type: X7R  [CAP0201]  (hidden comment: ChipCap 0.1u X7R)
C17  value 0.1uF  Type: X7R  [CAP0201]  (hidden comment: ChipCap 0.1u X7R)
C18  value 0.1uF  Type: X7R  [CAP0201]  (hidden comment: ChipCap 0.1u X7R)
C19  value 0.1uF  Type: X7R  [CAP0201]  (hidden comment: ChipCap 0.1u X7R)
C20  value 0.1uF  Type: X7R  [CAP0201]  (hidden comment: ChipCap 0.1u X7R)
C21  value 0.1uF  Type: X7R  [CAP0201]  (hidden comment: ChipCap 0.1u X7R)
C22  value 0.1uF  Type: X7R  [CAP0201]  (hidden comment: ChipCap 0.1u X7R)
C23  value 0.1uF  Type: X7R  [CAP0201]  (hidden comment: ChipCap 0.1u X7R)
C24  value 0.1uF  Type: X7R  [CAP0201]  (hidden comment: ChipCap 0.1u X7R)
C25  value 0.1uF  Type: X7R  [CAP0201]  (hidden comment: ChipCap 0.1u X7R)
C26  value 0.1uF  Type: X7R  [CAP0201]  (hidden comment: ChipCap 0.1u X7R)
C27  value 0.1uF  Type: X7R  [CAP0201]  (hidden comment: ChipCap 0.1u X7R)
C28  value 0.1uF  Type: X7R  [CAP0201]  (hidden comment: ChipCap 0.1u X7R)
C29  value 0.1uF  Type: X7R  [CAP0603]  (hidden comment: ChipCap 0.1u X7R)
C30  value 22uF  Type: X7R  [CAP0603]  (hidden comment: ChipCap 22u X7R)
C31  value 22uF  Type: X7R  [CAP0603]  (hidden comment: ChipCap 22u X7R)
C32  value 22uF  Type: X7R  [CAP0805]  (hidden comment: ChipCap 22u X7R)
C33  value 22uF  Type: X7R  [CAP0805]  (hidden comment: ChipCap 22u X7R)
C?#1  value 10uF  Type: X7R  [CAP1210]  (hidden comment: ChipCap 10u X7R)  (masked out: inside a compile mask, not in the netlist)
C?#2  value 10uF  Type: X7R  [CAP1210]  (hidden comment: ChipCap 10u X7R)  (masked out: inside a compile mask, not in the netlist)
C?#3  value 0.1uF  Type: X7R  [CAP0603]  (hidden comment: ChipCap 0.1u X7R)  (masked out: inside a compile mask, not in the netlist)
C?#4  value 22uF  Type: X7R  [CAP1210]  (hidden comment: ChipCap 22u X7R)  (masked out: inside a compile mask, not in the netlist)
C?#5  value 22uF  Type: X7R  [CAP1210]  (hidden comment: ChipCap 22u X7R)  (masked out: inside a compile mask, not in the netlist)
C?#6  value 22uF  Type: X7R  [CAP1210]  (hidden comment: ChipCap 22u X7R)  (masked out: inside a compile mask, not in the netlist)
J1  Jumper  [J0603]  (value not drawn)
J2  Jumper  [J0603]  (value not drawn)
L?  Inductance  value 2.2uH  [CDRH5D28RHP]  (masked out: inside a compile mask, not in the netlist)
R11  value 10K  Rating: 1/10 W  [RES0805]  (hidden comment: ChipRes 10K 1%)
R12  value 10K  Rating: 1/10 W  [RES0805]  (hidden comment: ChipRes 10K 1%)
R?#1  value 47K  Rating: 1/10 W  [RES0603]  (hidden comment: ChipRes 47K 1%)  (masked out: inside a compile mask, not in the netlist)
R?#2  ChipRes 33K2 1%  value 33K2  Rating: 1/10 W  [RES0603]  (masked out: inside a compile mask, not in the netlist)
R?#3  ChipRes 10K 1%  value 10K  Rating: 1/10 W  [RES0603]  (masked out: inside a compile mask, not in the netlist)
U1  STM32F746NGH6  [TFBGA216]  (part L of 12)
U?  TPS563200  [SOT23-6]  (masked out: inside a compile mask, not in the netlist)

### Ports
NRESET

### Nets
+3V3: C7.1 C9.2 C10.2 C11.2 C12.2 C13.2 C14.2 C15.2 C16.2 C17.2 C18.2 C19.2 C20.2 C21.2 C22.2 C23.2 C24.2 C25.2 C26.2 C27.2 C28.2 C30.1 C31.1 C32.1 C33.1 R11.1 R12.1 U1.C1(VBAT) U1.E7(VDD) U1.E8(VDD) U1.E9(VDD) U1.E10(VDD) U1.F4(VDD) U1.F5(VDD) U1.F11(VDD) U1.G5(VDD) U1.G11(VDD_USB) U1.H5(VDD) U1.H11(VDD) U1.J5(VDD) U1.J11(VDD) U1.K5(VDD) U1.K11(VDD) U1.L5(BYPASSS_REG) U1.L7(VDD) U1.L8(VDD) U1.L9(VDD) U1.L10(VDD)
AVCC: C29.2 U1.R1(VDDA)
GND: C6.1 C7.2 C8.1 C9.1 C10.1 C11.1 C12.1 C13.1 C14.1 C15.1 C16.1 C17.1 C18.1 C19.1 C20.1 C21.1 C22.1 C23.1 C24.1 C25.1 C26.1 C27.1 C28.1 C29.1 C30.2 C31.2 C32.2 C33.2 J1.1 J2.1 U1.F2(VSS) U1.F6(VSS) U1.F7(VSS) U1.F8(VSS) U1.F9(VSS) U1.F10(VSS) U1.G6(VSS) U1.G10(VSS) U1.H6(VSS) U1.H10(VSS) U1.J6(VSS) U1.J10(VSS) U1.K6(VSS) U1.K7(VSS) U1.K8(VSS) U1.K9(VSS) U1.K10(VSS) U1.L6(VSS) U1.M1(VSSA)
NRESET: U1.J1(NRST) ; port NRESET
NetC6_2: C6.2 U1.L11(VCAP_1)
NetC8_2: C8.2 U1.E11(VCAP_2)
NetJ1_2: J1.2 R11.2 U1.E5(PDR_ON)
NetJ2_2: J2.2 R12.2 U1.E6(BOOT)

Not connected (* = marked no-connect by the designer): U1 N1(VREF-) P1(VREF+)

### Notes on the sheet
- REPLACE RESISTORS & CAPACITORS!
- 3Amps
- (near J1) NF
- (near R12) NF

### Library data of the parts
C6-C8 C30-C33 C?#4-C?#6 = ChipCap 22uF X7R: Surface-mount ceramic multilayer capacitor; Manufacturer: YAGEO; Voltage: 25V; Tolerance: 10%; ComponentLink1Description: Datasheet; ComponentLink1URL: http://www.deaha.com/pdf/YAGEO-CC_series.pdf
C9-C29 C?#3 = ChipCap 0.1uF X7R: as C5 on sheet [0] Strathim MCU; ComponentLink1Description: Datasheet; ComponentLink1URL: http://www.deaha.com/pdf/YAGEO-CC_series.pdf
C?#1 C?#2 = ChipCap 10uF X7R: as C52 on sheet [1] NAND FLASH and SDRAM; ComponentLink1Description: Datasheet; ComponentLink1URL: http://www.deaha.com/pdf/YAGEO-CC_series.pdf
L? = ChipInductance
R11 R12 R?#3 = ChipRes 10K 1%: Think Film Chip resistor; Temperature Coefficient: 200ppm/K; Tolerance: 1%; Type: ThickFilm
R?#1 = ChipRes 47K 1%: Think Film Chip resistor; Temperature Coefficient: 200ppm/K; Tolerance: 1%; Type: ThickFilm
R?#2 = ChipRes 33K2 1%: Think Film Chip resistor; Temperature Coefficient: 200ppm/K; Tolerance: 1%; Type: ThickFilm
U1 = STM32F746NGH6: ARM Cortex M7, 462DMIPS, 1MB Flash
U? = TPS563200: 3A Synchronous Step-Down Voltage Regulator; Voltage: 4.5-17V; Current: 3Amps; ComponentLink1Description: Datasheet; ComponentLink1URL: www.ti.com/lit/ds/symlink/tps563200.pdf; Supplier 1: Compel; Supplier URL 1: www.compel.ru; Supplier Part Number 1: TPS563200DDCT

## Sheet [3] Connectors.SchDoc
size A4
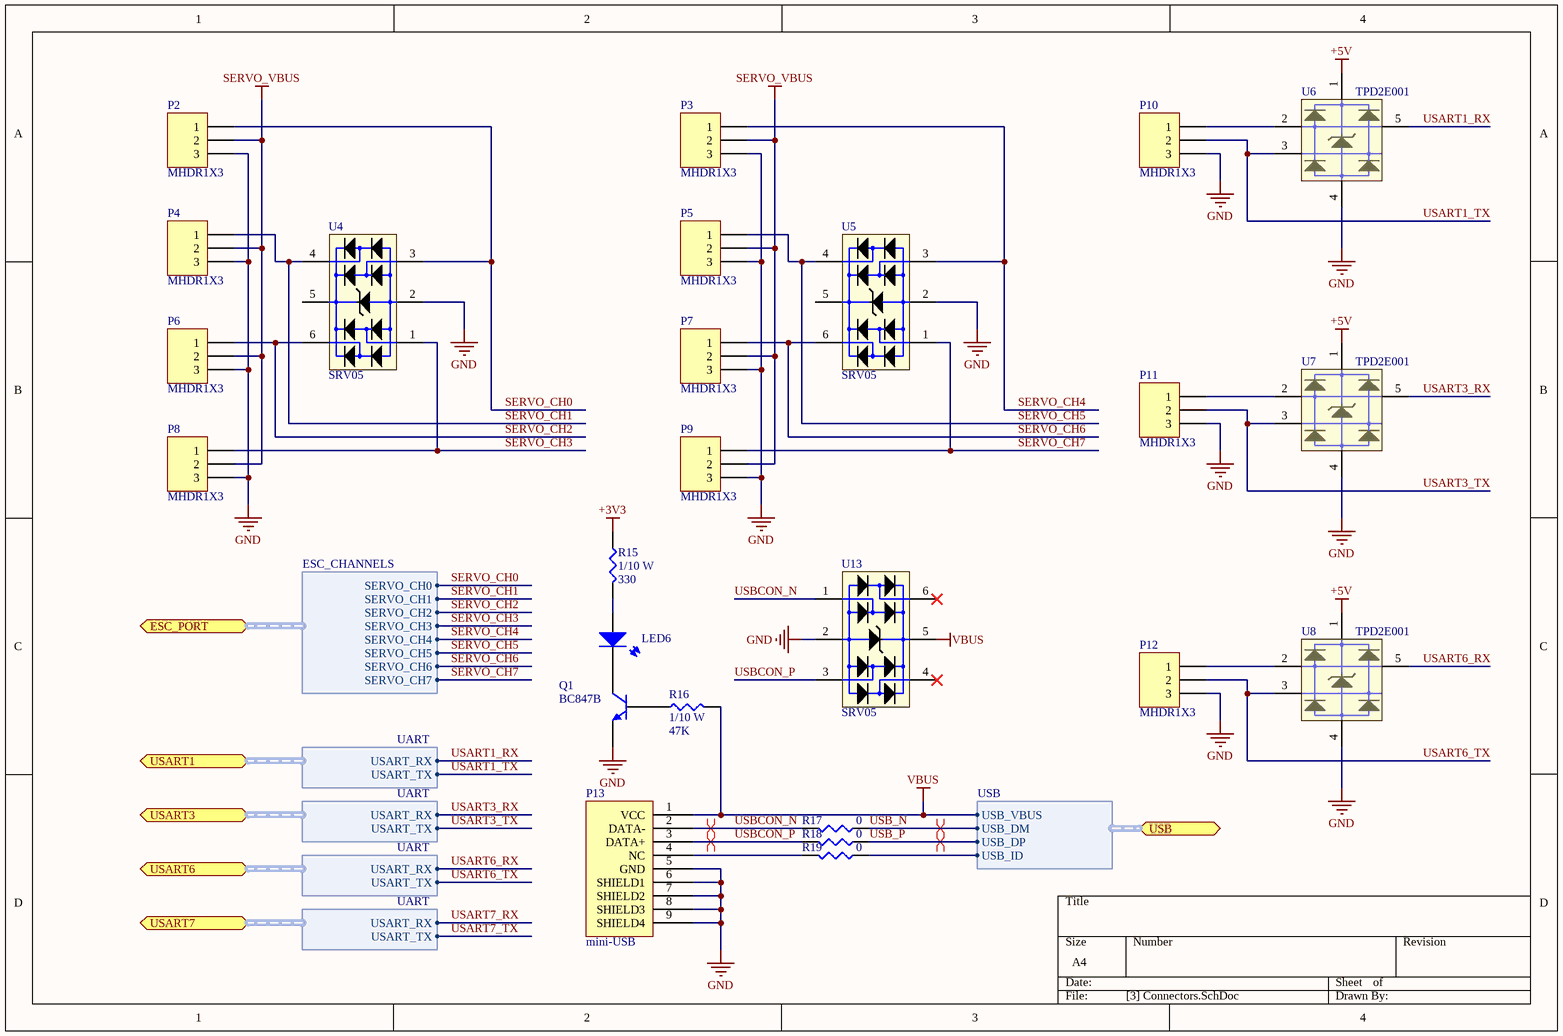
[diagram p4: [3] Connectors.SchDoc]

### Parts
LED6  LED 0603  [LED 0603]  (value not drawn)
P2  MHDR1X3  [MHDR1X3]
P3  MHDR1X3  [MHDR1X3]
P4  MHDR1X3  [MHDR1X3]
P5  MHDR1X3  [MHDR1X3]
P6  MHDR1X3  [MHDR1X3]
P7  MHDR1X3  [MHDR1X3]
P8  MHDR1X3  [MHDR1X3]
P9  MHDR1X3  [MHDR1X3]
P10  MHDR1X3  [MHDR1X3]
P11  MHDR1X3  [MHDR1X3]
P12  MHDR1X3  [MHDR1X3]
P13  mini-USB  [USB/SM0.8-6H5]
Q1  BC847B  [SOT23]
R15  value 330  Rating: 1/10 W  [RES0805]  (hidden comment: ChipRes 330R 1%)
R16  value 47K  Rating: 1/10 W  [RES0805]  (hidden comment: ChipRes 47K 1%)
R17  value 0  [RES0805]  (hidden comment: ChipRes)
R18  value 0  [RES0805]  (hidden comment: ChipRes)
R19  value 0  [RES0805]  (hidden comment: ChipRes)
U4  SRV05  [SOT23-6]
U5  SRV05  [SOT23-6]
U6  TPD2E001  [SOT23-5]
U7  TPD2E001  [SOT23-5]
U8  TPD2E001  [SOT23-5]
U13  SRV05  [SOT23-6]

### Ports
ESC_PORT (harness ESC_CHANNELS), USART1 (harness UART), USART3 (harness UART), USART6 (harness UART), USART7 (harness UART), USB (harness USB)

### Harnesses
ESC_CHANNELS: SERVO_CH0, SERVO_CH1, SERVO_CH2, SERVO_CH3, SERVO_CH4, SERVO_CH5, SERVO_CH6, SERVO_CH7
UART: USART_RX, USART_TX
USB: USB_DM, USB_DP, USB_ID, USB_VBUS

### Nets
+3V3: R15.1
+5V: U6.1 U7.1 U8.1
GND: P2.3 P3.3 P4.3 P5.3 P6.3 P7.3 P8.3 P9.3 P10.3 P11.3 P12.3 P13.5(GND) P13.6(SHIELD1) P13.7(SHIELD2) P13.8(SHIELD3) P13.9(SHIELD4) Q1.2(E) U4.2 U5.2 U6.4 U7.4 U8.4 U13.2
SERVO_VBUS: P2.2 P3.2 P4.2 P5.2 P6.2 P7.2 P8.2 P9.2
VBUS: P13.1(VCC) R16.2 U13.5 ; port USB.USB_VBUS
SERVO_CH0: P2.1 U4.3 ; port ESC_PORT.SERVO_CH0
SERVO_CH1: P4.1 U4.4 ; port ESC_PORT.SERVO_CH1
SERVO_CH2: P6.1 U4.6 ; port ESC_PORT.SERVO_CH2
SERVO_CH3: P8.1 U4.1 ; port ESC_PORT.SERVO_CH3
SERVO_CH4: P3.1 U5.3 ; port ESC_PORT.SERVO_CH4
SERVO_CH5: P5.1 U5.4 ; port ESC_PORT.SERVO_CH5
SERVO_CH6: P7.1 U5.6 ; port ESC_PORT.SERVO_CH6
SERVO_CH7: P9.1 U5.1 ; port ESC_PORT.SERVO_CH7
USART1_RX: U6.5 ; port USART1.USART_RX
USART1_TX: P10.2 U6.3 ; port USART1.USART_TX  [project net QUADSPI_NCS]
USART3_RX: U7.5 ; port USART3.USART_RX
USART3_TX: P11.2 U7.3 ; port USART3.USART_TX
USART6_RX: U8.5 ; port USART6.USART_RX
USART6_TX: P12.2 U8.3 ; port USART6.USART_TX
USB_HS_ID: R19.1 ; port USB.USB_ID
USB_N: R17.1 ; port USB.USB_DM  [project net USB_HS_N]
USB_P: R18.1 ; port USB.USB_DP  [project net USB_HS_P]
USBCON_N: P13.2(DATA-) R17.2 U13.1
USBCON_P: P13.3(DATA+) R18.2 U13.3
NetLED6_1: LED6.1 Q1.1(C)
NetLED6_2: LED6.2 R15.2
NetP10_1: P10.1 U6.2
NetP11_1: P11.1 U7.2
NetP12_1: P12.1 U8.2
NetP13_4: P13.4(NC) R19.2
NetQ1_3: Q1.3(B) R16.1

Not connected (* = marked no-connect by the designer): U4 5; U5 5; U13 4* 6*

### Layout directives
differential pair: USB_HS_N, USB_HS_P, USBCON_N, USBCON_P

### Library data of the parts
LED6 = LED0603
P2-P12 = MHDR1X3: Header, 3-Pin; LatestRevisionDate: 17-Jul-2002; LatestRevisionNote: Re-released for DXP Platform.; Publisher: Altium Limited
P13 = miniUSB
Q1 = BC847B: SOT23 NPN Silicon Planar General Purpose Transistor; Published: 8-Jun-2000; LatestRevisionDate: 17-Jul-2002; LatestRevisionNote: Re-released for DXP Platform.; DatasheetVersion: Jan-1997; PackageVersion: 1996; PackageReference: SOT23; Publisher: Altium Limited; PackageDescription: SOT-23; 3 Leads; Body 3.1 x 2.5 mm, inc. leads (LxW max), Alternate Lead Configuration; ComponentLink1Description: Manufacturer Link; ComponentLink1URL: http://www.zetex.com/
R15 = ChipRes 330R 1%: Think Film Chip resistor; Temperature Coefficient: 200ppm/K; Tolerance: 1%; Type: ThickFilm
R16 = ChipRes 47K 1%: as R?#1 on sheet [2] Power; Tolerance: 1%; Type: ThickFilm
R17-R19 = ChipRes: Chip resistor
U4 U5 U13 = SRV05: Protection 6V 10A
U6-U8 = TPD2E001: Low-Capacitance 2-Channel ESD-Protection for High-Speed Data Interfaces

## Sheet [4] Sensors.SchDoc
size A
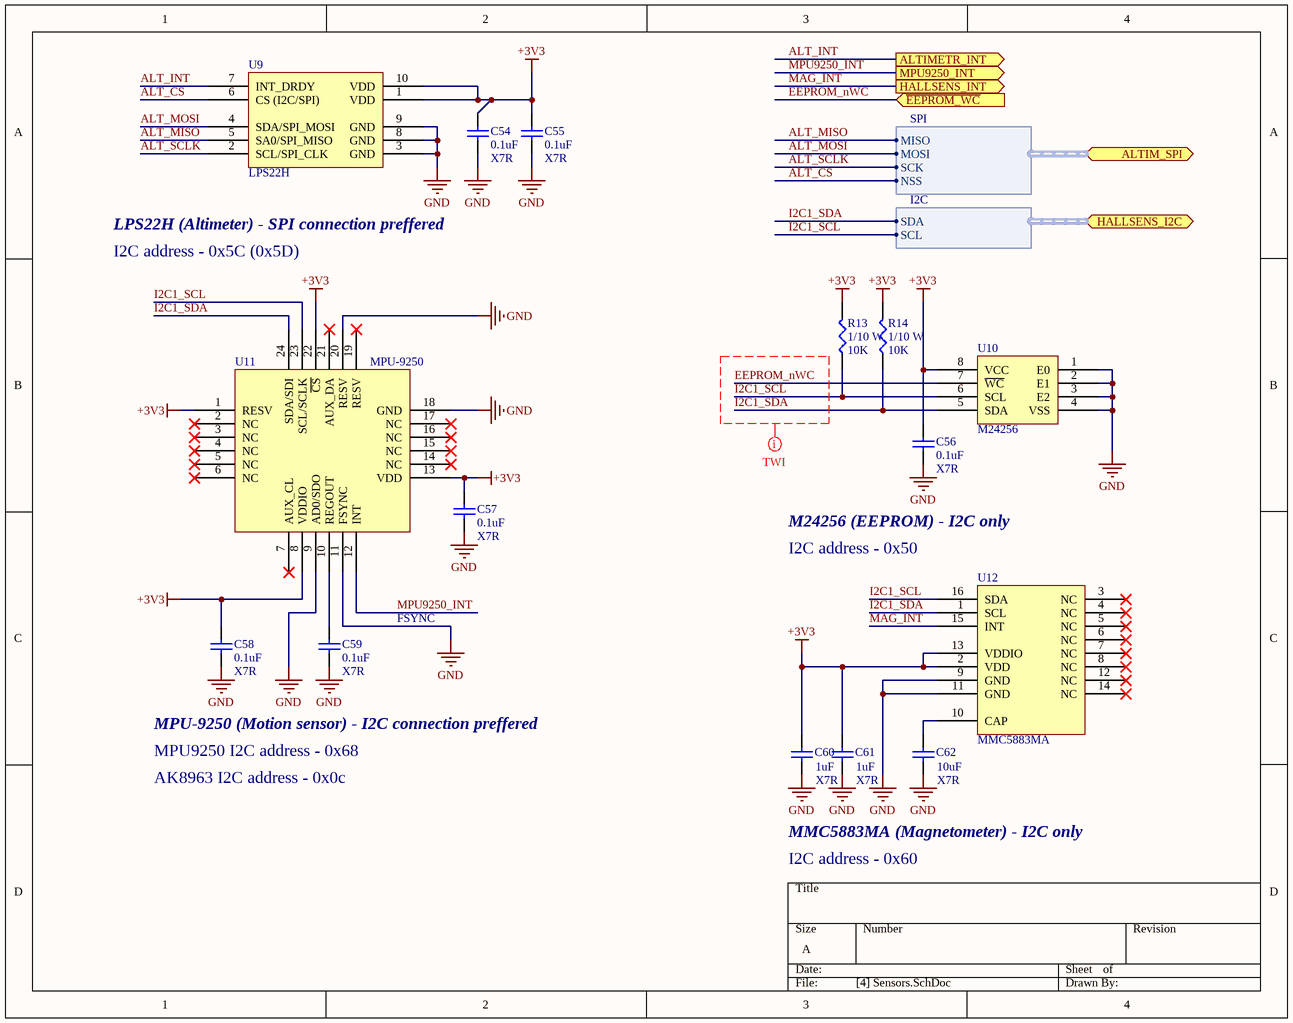
[diagram p5: [4] Sensors.SchDoc]

### Parts
C54  value 0.1uF  Type: X7R  [CAP0402]  (hidden comment: ChipCap 0.1u X7R)
C55  value 0.1uF  Type: X7R  [CAP0402]  (hidden comment: ChipCap 0.1u X7R)
C56  value 0.1uF  Type: X7R  [CAP0603]  (hidden comment: ChipCap 0.1u X7R)
C57  value 0.1uF  Type: X7R  [CAP0603]  (hidden comment: ChipCap 0.1u X7R)
C58  value 0.1uF  Type: X7R  [CAP0603]  (hidden comment: ChipCap 0.1u X7R)
C59  value 0.1uF  Type: X7R  [CAP0603]  (hidden comment: ChipCap 0.1u X7R)
C60  value 1uF  Type: X7R  [CAP0603]  (hidden comment: ChipCap 1u X7R)
C61  value 1uF  Type: X7R  [CAP0603]  (hidden comment: ChipCap 1u X7R)
C62  value 10uF  Type: X7R  [CAP0805]  (hidden comment: ChipCap 10u X7R)
R13  value 10K  Rating: 1/10 W  [RES0805]  (hidden comment: ChipRes 10K 1%)
R14  value 10K  Rating: 1/10 W  [RES0805]  (hidden comment: ChipRes 10K 1%)
U9  LPS22H  [HLGA-10L]
U10  M24256  [SOIC8]
U11  MPU-9250  [QFN24]
U12  MMC5883MA  [LGA16]

### Ports
ALTIM_SPI (harness SPI), ALTIMETR_INT (out), HALLSENS_I2C (harness I2C), HALLSENS_INT (out), MPU9250_INT (out), ~{EEPROM_WC} (in)

### Harnesses
SPI: MISO, MOSI, SCK, NSS
I2C: SDA, SCL

### Nets
+3V3: C54.2 C55.2 C56.2 C57.2 C58.2 C60.2 C61.2 R13.2 R14.2 U9.1(VDD) U9.10(VDD) U10.8(VCC) U11.1(RESV) U11.8(VDDIO) U11.13(VDD) U11.22(~{CS}) U12.2(VDD) U12.13(VDDIO)
GND: C54.1 C55.1 C56.1 C57.1 C58.1 C59.1 C60.1 C61.1 C62.1 U9.3(GND) U9.8(GND) U9.9(GND) U10.1(E0) U10.2(E1) U10.3(E2) U10.4(VSS) U11.9(AD0/SDO) U11.11(FSYNC) U11.18(GND) U11.20(RESV) U12.9(GND) U12.11(GND)
ALT_CS: U9.6(CS_(I2C/SPI)) ; port ALTIM_SPI.NSS
ALT_INT: U9.7(INT_DRDY) ; port ALTIMETR_INT
ALT_MISO: U9.5(SA0/SPI_MISO) ; port ALTIM_SPI.MISO
ALT_MOSI: U9.4(SDA/SPI_MOSI) ; port ALTIM_SPI.MOSI
ALT_SCLK: U9.2(SCL/SPI_CLK) ; port ALTIM_SPI.SCK
EEPROM_nWC: U10.7(~{WC}) ; port ~{EEPROM_WC}
I2C1_SCL: R13.1 U10.6(SCL) U11.23(SCL/SCLK) U12.16(SDA) ; port HALLSENS_I2C.SCL
I2C1_SDA: R14.1 U10.5(SDA) U11.24(SDA/SDI) U12.1(SCL) ; port HALLSENS_I2C.SDA
MAG_INT: U12.15(INT) ; port HALLSENS_INT
MPU9250_INT: U11.12(INT) ; port MPU9250_INT
NetC59_2: C59.2 U11.10(REGOUT)
NetC62_2: C62.2 U12.10(CAP)

Not connected (* = marked no-connect by the designer): U11 2(NC)* 3(NC)* 4(NC)* 5(NC)* 6(NC)* 7(AUX_CL)* 14(NC)* 15(NC)* 16(NC)* 17(NC)* 19(RESV)* 21(AUX_DA)*; U12 3(NC)* 4(NC)* 5(NC)* 6(NC)* 7(NC)* 8(NC)* 12(NC)* 14(NC)*

### Layout directives
net class TWI: EEPROM_nWC, I2C1_SCL, I2C1_SDA

### Notes on the sheet
- LPS22H (Altimeter) - SPI connection preffered
- I2C address - 0x5C (0x5D)
- M24256 (EEPROM) - I2C only
- I2C address - 0x50
- FSYNC
- MPU-9250 (Motion sensor) - I2C connection preffered
- MPU9250 I2C address - 0x68
- AK8963 I2C address - 0x0c
- MMC5883MA (Magnetometer) - I2C only
- I2C address - 0x60

### Library data of the parts
C54-C59 = ChipCap 0.1uF X7R: as C5 on sheet [0] Strathim MCU; ComponentLink1Description: Datasheet; ComponentLink1URL: http://www.deaha.com/pdf/YAGEO-CC_series.pdf
C60 C61 = ChipCap 1uF X7R: Surface-mount ceramic multilayer capacitor; Manufacturer: YAGEO; Voltage: 25V; Tolerance: 10%; ComponentLink1Description: Datasheet; ComponentLink1URL: http://www.deaha.com/pdf/YAGEO-CC_series.pdf
C62 = ChipCap 10uF X7R: as C52 on sheet [1] NAND FLASH and SDRAM; ComponentLink1Description: Datasheet; ComponentLink1URL: http://www.deaha.com/pdf/YAGEO-CC_series.pdf
R13 R14 = ChipRes 10K 1%: as R11 on sheet [2] Power; Tolerance: 1%; Type: ThickFilm
U9 = LPS22H: MEMS nano pressure sensor: 260-1260 hPa
U10 = M24256: 256 Kbit I2C EEPROM
U11 = MPU-9250: 9-Axis sensor
U12 = MMC5883MA: 3-axis Magnetic Sensor

## Nets that join several sheets
+3V3: [0] Strathim MCU (11 pins), [1] NAND FLASH and SDRAM (38 pins), [2] Power (48 pins), [3] Connectors (R15.1), [4] Sensors (18 pins)
GND: [0] Strathim MCU (8 pins), [1] NAND FLASH and SDRAM (38 pins), [2] Power (49 pins), [3] Connectors (23 pins), [4] Sensors (22 pins)
ALT_CS: [0] Strathim MCU (U1.B4), [4] Sensors (U9.6)
ALT_MISO: [0] Strathim MCU (U1.M4), [4] Sensors (U9.5)
ALT_MOSI: [0] Strathim MCU (U1.M3), [4] Sensors (U9.4)
ALT_SCLK: [0] Strathim MCU (U1.K14), [4] Sensors (U9.2)
NAND_ALE: [0] Strathim MCU (U1.M10), [1] NAND FLASH and SDRAM (U3.C4)
NAND_CLE: [0] Strathim MCU (U1.N10), [1] NAND FLASH and SDRAM (U3.D5)
NAND_nCE: [0] Strathim MCU (U1.D9), [1] NAND FLASH and SDRAM (U3.C6)
NAND_nR/B: [0] Strathim MCU (U1.B11), [1] NAND FLASH and SDRAM (U3.C8)
NAND_nRE: [0] Strathim MCU (U1.D11), [1] NAND FLASH and SDRAM (U3.D4)
NAND_nWE: [0] Strathim MCU (U1.C10 U1.J3), [1] NAND FLASH and SDRAM (U2.K8 U3.C7)
NAND_nWP: [0] Strathim MCU (U1.M12), [1] NAND FLASH and SDRAM (U3.C3)
NRESET: [0] Strathim MCU (TP1.5), [2] Power (U1.J1)
QUADSPI_NCS: [0] Strathim MCU (U1.B6), [3] Connectors (P10.2 U6.3)
RAM_ADDR0: [0] Strathim MCU (U1.D2), [1] NAND FLASH and SDRAM (U2.G8)
RAM_ADDR1: [0] Strathim MCU (U1.E2), [1] NAND FLASH and SDRAM (U2.G9)
RAM_ADDR2: [0] Strathim MCU (U1.G2), [1] NAND FLASH and SDRAM (U2.F7)
RAM_ADDR3: [0] Strathim MCU (U1.H2), [1] NAND FLASH and SDRAM (U2.F3)
RAM_ADDR4: [0] Strathim MCU (U1.J2), [1] NAND FLASH and SDRAM (U2.G1)
RAM_ADDR5: [0] Strathim MCU (U1.K3), [1] NAND FLASH and SDRAM (U2.G2)
RAM_ADDR6: [0] Strathim MCU (U1.M6), [1] NAND FLASH and SDRAM (U2.G3)
RAM_ADDR7: [0] Strathim MCU (U1.N6), [1] NAND FLASH and SDRAM (U2.H1)
RAM_ADDR8: [0] Strathim MCU (U1.P6), [1] NAND FLASH and SDRAM (U2.H2)
RAM_ADDR9: [0] Strathim MCU (U1.M8), [1] NAND FLASH and SDRAM (U2.J3)
RAM_ADDR10: [0] Strathim MCU (U1.N7), [1] NAND FLASH and SDRAM (U2.G7)
RAM_ADDR11: [0] Strathim MCU (U1.M7), [1] NAND FLASH and SDRAM (U2.H9)
RAM_I/O0: [0] Strathim MCU (U1.L12), [1] NAND FLASH and SDRAM (U2.R8 U3.H4)
RAM_I/O1: [0] Strathim MCU (U1.K13), [1] NAND FLASH and SDRAM (U2.N7 U3.J4)
RAM_I/O2: [0] Strathim MCU (U1.B12), [1] NAND FLASH and SDRAM (U2.R9 U3.K4)
RAM_I/O3: [0] Strathim MCU (U1.C12), [1] NAND FLASH and SDRAM (U2.N8 U3.K5)
RAM_I/O4: [0] Strathim MCU (U1.R8), [1] NAND FLASH and SDRAM (U2.P9 U3.K6)
RAM_I/O5: [0] Strathim MCU (U1.N9), [1] NAND FLASH and SDRAM (U2.M8 U3.J7)
RAM_I/O6: [0] Strathim MCU (U1.P9), [1] NAND FLASH and SDRAM (U2.M7 U3.K7)
RAM_I/O7: [0] Strathim MCU (U1.R9), [1] NAND FLASH and SDRAM (U2.L8 U3.J8)
RAM_I/O8: [0] Strathim MCU (U1.P10), [1] NAND FLASH and SDRAM (U2.L2)
RAM_I/O9: [0] Strathim MCU (U1.R10), [1] NAND FLASH and SDRAM (U2.M3)
RAM_I/O10: [0] Strathim MCU (U1.R12), [1] NAND FLASH and SDRAM (U2.M2)
RAM_I/O11: [0] Strathim MCU (U1.P11), [1] NAND FLASH and SDRAM (U2.P1)
RAM_I/O12: [0] Strathim MCU (U1.R11), [1] NAND FLASH and SDRAM (U2.N2)
RAM_I/O13: [0] Strathim MCU (U1.L15), [1] NAND FLASH and SDRAM (U2.R1)
RAM_I/O14: [0] Strathim MCU (U1.L14), [1] NAND FLASH and SDRAM (U2.N3)
RAM_I/O15: [0] Strathim MCU (U1.K15), [1] NAND FLASH and SDRAM (U2.R2)
RAM_I/O16: [0] Strathim MCU (U1.P14), [1] NAND FLASH and SDRAM (U2.E8)
RAM_I/O17: [0] Strathim MCU (U1.N14), [1] NAND FLASH and SDRAM (U2.D7)
RAM_I/O18: [0] Strathim MCU (U1.P15), [1] NAND FLASH and SDRAM (U2.D8)
RAM_I/O19: [0] Strathim MCU (U1.N15), [1] NAND FLASH and SDRAM (U2.B9)
RAM_I/O20: [0] Strathim MCU (U1.M15), [1] NAND FLASH and SDRAM (U2.C8)
RAM_I/O21: [0] Strathim MCU (U1.E12), [1] NAND FLASH and SDRAM (U2.A9)
RAM_I/O22: [0] Strathim MCU (U1.E13), [1] NAND FLASH and SDRAM (U2.C7)
RAM_I/O23: [0] Strathim MCU (U1.D13), [1] NAND FLASH and SDRAM (U2.A8)
RAM_I/O24: [0] Strathim MCU (U1.E14), [1] NAND FLASH and SDRAM (U2.A2)
RAM_I/O25: [0] Strathim MCU (U1.D14), [1] NAND FLASH and SDRAM (U2.C3)
RAM_I/O26: [0] Strathim MCU (U1.C14), [1] NAND FLASH and SDRAM (U2.A1)
RAM_I/O27: [0] Strathim MCU (U1.C13), [1] NAND FLASH and SDRAM (U2.C2)
RAM_I/O28: [0] Strathim MCU (U1.D6), [1] NAND FLASH and SDRAM (U2.B1)
RAM_I/O29: [0] Strathim MCU (U1.D4), [1] NAND FLASH and SDRAM (U2.D2)
RAM_I/O30: [0] Strathim MCU (U1.E4), [1] NAND FLASH and SDRAM (U2.D3)
RAM_I/O31: [0] Strathim MCU (U1.D5), [1] NAND FLASH and SDRAM (U2.E2)
SDRAM_BA0: [0] Strathim MCU (U1.N12), [1] NAND FLASH and SDRAM (U2.J7)
SDRAM_BA1: [0] Strathim MCU (U1.N11), [1] NAND FLASH and SDRAM (U2.H8)
SDRAM_CKE: [0] Strathim MCU (U1.K4), [1] NAND FLASH and SDRAM (U2.J2)
SDRAM_CLK: [0] Strathim MCU (U1.H14), [1] NAND FLASH and SDRAM (U2.J1)
SDRAM_DQM0: [0] Strathim MCU (U1.A6), [1] NAND FLASH and SDRAM (U2.K9)
SDRAM_DQM1: [0] Strathim MCU (U1.A5), [1] NAND FLASH and SDRAM (U2.K1)
SDRAM_DQM2: [0] Strathim MCU (U1.C3), [1] NAND FLASH and SDRAM (U2.F8)
SDRAM_DQM3: [0] Strathim MCU (U1.D3), [1] NAND FLASH and SDRAM (U2.F2)
SDRAM_nCAS: [0] Strathim MCU (U1.B7), [1] NAND FLASH and SDRAM (U2.K7)
SDRAM_nCS: [0] Strathim MCU (U1.J4), [1] NAND FLASH and SDRAM (U2.J8)
SDRAM_nRAS: [0] Strathim MCU (U1.P8), [1] NAND FLASH and SDRAM (U2.J9)
SERVO_CH0: [0] Strathim MCU (U1.F15), [3] Connectors (P2.1 U4.3)
SERVO_CH1: [0] Strathim MCU (U1.E15), [3] Connectors (P4.1 U4.4)
SERVO_CH2: [0] Strathim MCU (U1.D15), [3] Connectors (P6.1 U4.6)
SERVO_CH3: [0] Strathim MCU (U1.C15), [3] Connectors (P8.1 U4.1)
SERVO_CH4: [0] Strathim MCU (U1.P3), [3] Connectors (P3.1 U5.3)
SERVO_CH5: [0] Strathim MCU (U1.R3), [3] Connectors (P5.1 U5.4)
SERVO_CH6: [0] Strathim MCU (U1.R5), [3] Connectors (P7.1 U5.6)
SERVO_CH7: [0] Strathim MCU (U1.R4), [3] Connectors (P9.1 U5.1)
USART1_RX: [0] Strathim MCU (U1.B5), [3] Connectors (U6.5)
USART3_RX: [0] Strathim MCU (U1.R13), [3] Connectors (U7.5)
USART3_TX: [0] Strathim MCU (U1.P12), [3] Connectors (P11.2 U7.3)
USART6_RX: [0] Strathim MCU (U1.G15), [3] Connectors (U8.5)
USART6_TX: [0] Strathim MCU (U1.H15), [3] Connectors (P12.2 U8.3)
USB_HS_ID: [0] Strathim MCU (U1.L13), [3] Connectors (R19.1)
USB_HS_N: [0] Strathim MCU (U1.R14), [3] Connectors (R17.1)
USB_HS_P: [0] Strathim MCU (U1.R15), [3] Connectors (R18.1)